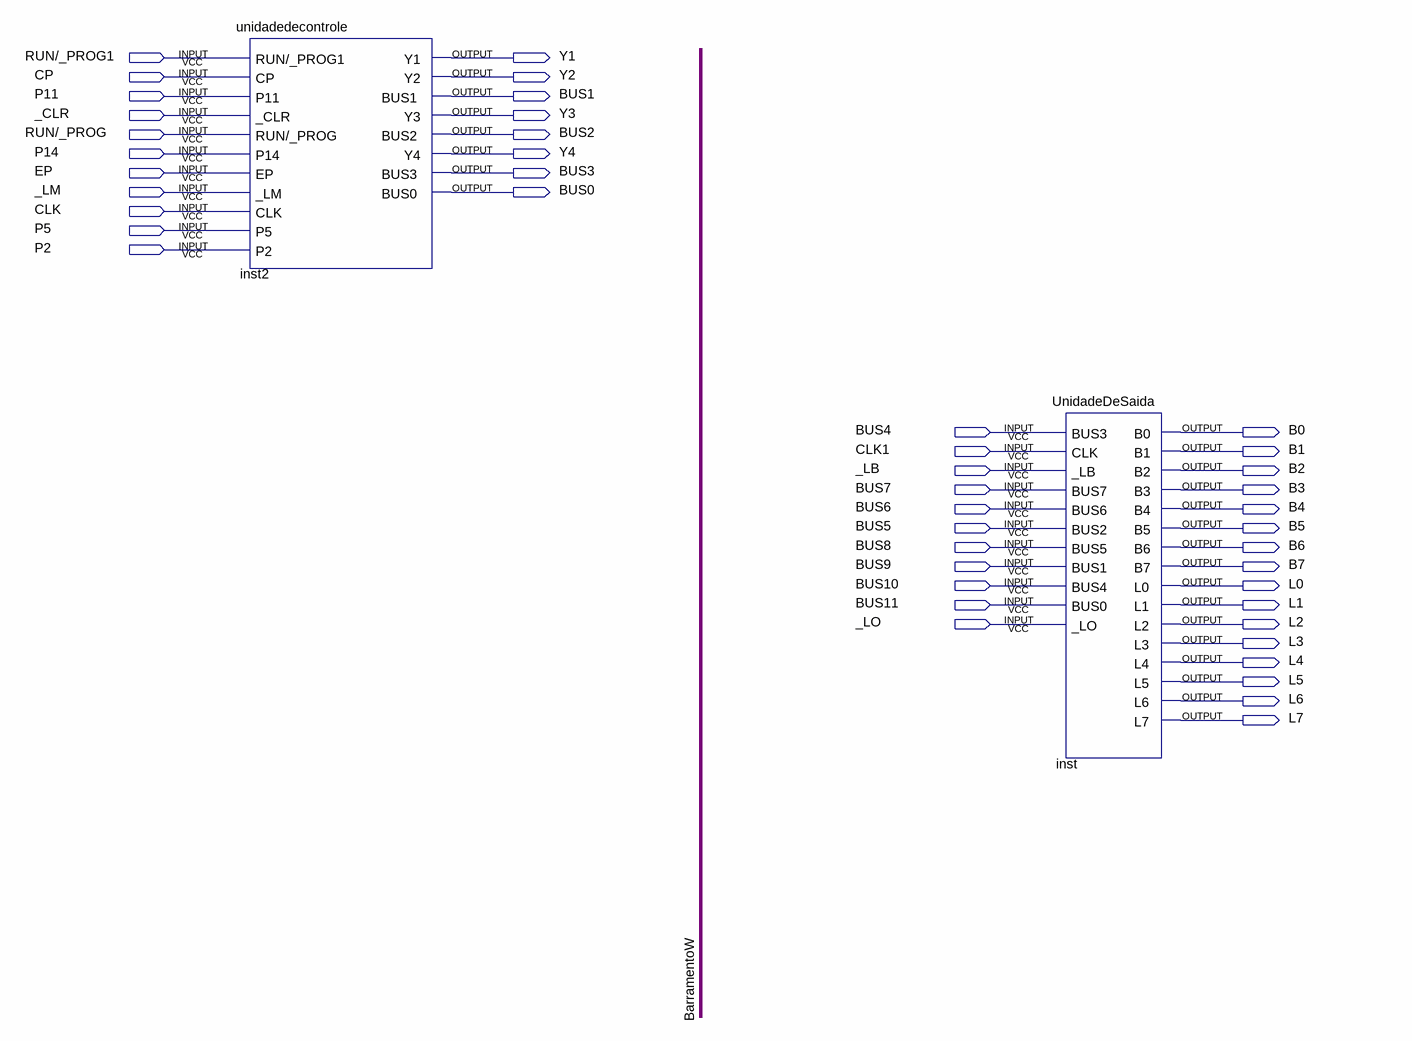
[diagram p0: schematic sheet]
// Quartus schematic MicroComputadorSAP.bdf as structural Verilog: 2 symbols, 46 pins
module MicroComputadorSAP (
  input  \RUN/_PROG1 ,
  input  CP,
  input  P11,
  input  _CLR,
  input  \RUN/_PROG ,
  input  P14,
  input  EP,
  input  _LM,
  input  CLK,
  input  P5,
  input  P2,
  input  BUS4,
  input  CLK1,
  input  _LB,
  input  BUS7,
  input  BUS6,
  input  BUS5,
  input  BUS8,
  input  BUS9,
  input  BUS10,
  input  BUS11,
  input  _LO,
  output Y1,
  output Y2,
  output BUS1,
  output Y3,
  output BUS2,
  output Y4,
  output BUS3,
  output BUS0,
  output B0,
  output B1,
  output B2,
  output B3,
  output B4,
  output B5,
  output B6,
  output B7,
  output L0,
  output L1,
  output L2,
  output L3,
  output L4,
  output L5,
  output L6,
  output L7
);

  unidadedecontrole inst2 (
    .\RUN/_PROG1 (\RUN/_PROG1 ), .CP(CP), .P11(P11), ._CLR(_CLR), .\RUN/_PROG (\RUN/_PROG ), .P14(P14),
    .EP(EP), ._LM(_LM), .CLK(CLK), .P5(P5), .P2(P2), .Y1(Y1), .Y2(Y2), .BUS1(BUS1), .Y3(Y3), .BUS2(BUS2),
    .Y4(Y4), .BUS3(BUS3), .BUS0(BUS0));
  UnidadeDeSaida inst (
    .B0(B0), .B1(B1), .B2(B2), .B3(B3), .B4(B4), .B5(B5), .B6(B6), .B7(B7), .L0(L0), .L1(L1), .L2(L2),
    .L3(L3), .L4(L4), .L5(L5), .L6(L6), .L7(L7));  // open: BUS3, CLK, _LB, BUS7, BUS6, BUS2, BUS5, BUS1, BUS4, BUS0, _LO
endmodule
